# Altium schematic sheet FIT_TCM_ADCLK854.SchDoc: FIT_PM12 board
size 420 x 297 mm; CheckedBy: G.Kasprowicz; Author: INR Moscow; CompanyName: WUT ISE; DrawnBy: M.Podgórski; Organization: WUT ISE; Address1: PW ISE; Address2: Nowowiejska 15/19 00-665 Warsaw; Address3: gkasprow@gmail.com; Revision: 2; SheetNumber: -; SheetTotal: -; ModifiedBy: -; CheckedDate: -; Title2: Title 2; DivGrp: WUT ISE; Designer: INR RAS; ModifiedDate: -; ProjectName: Sensor Box
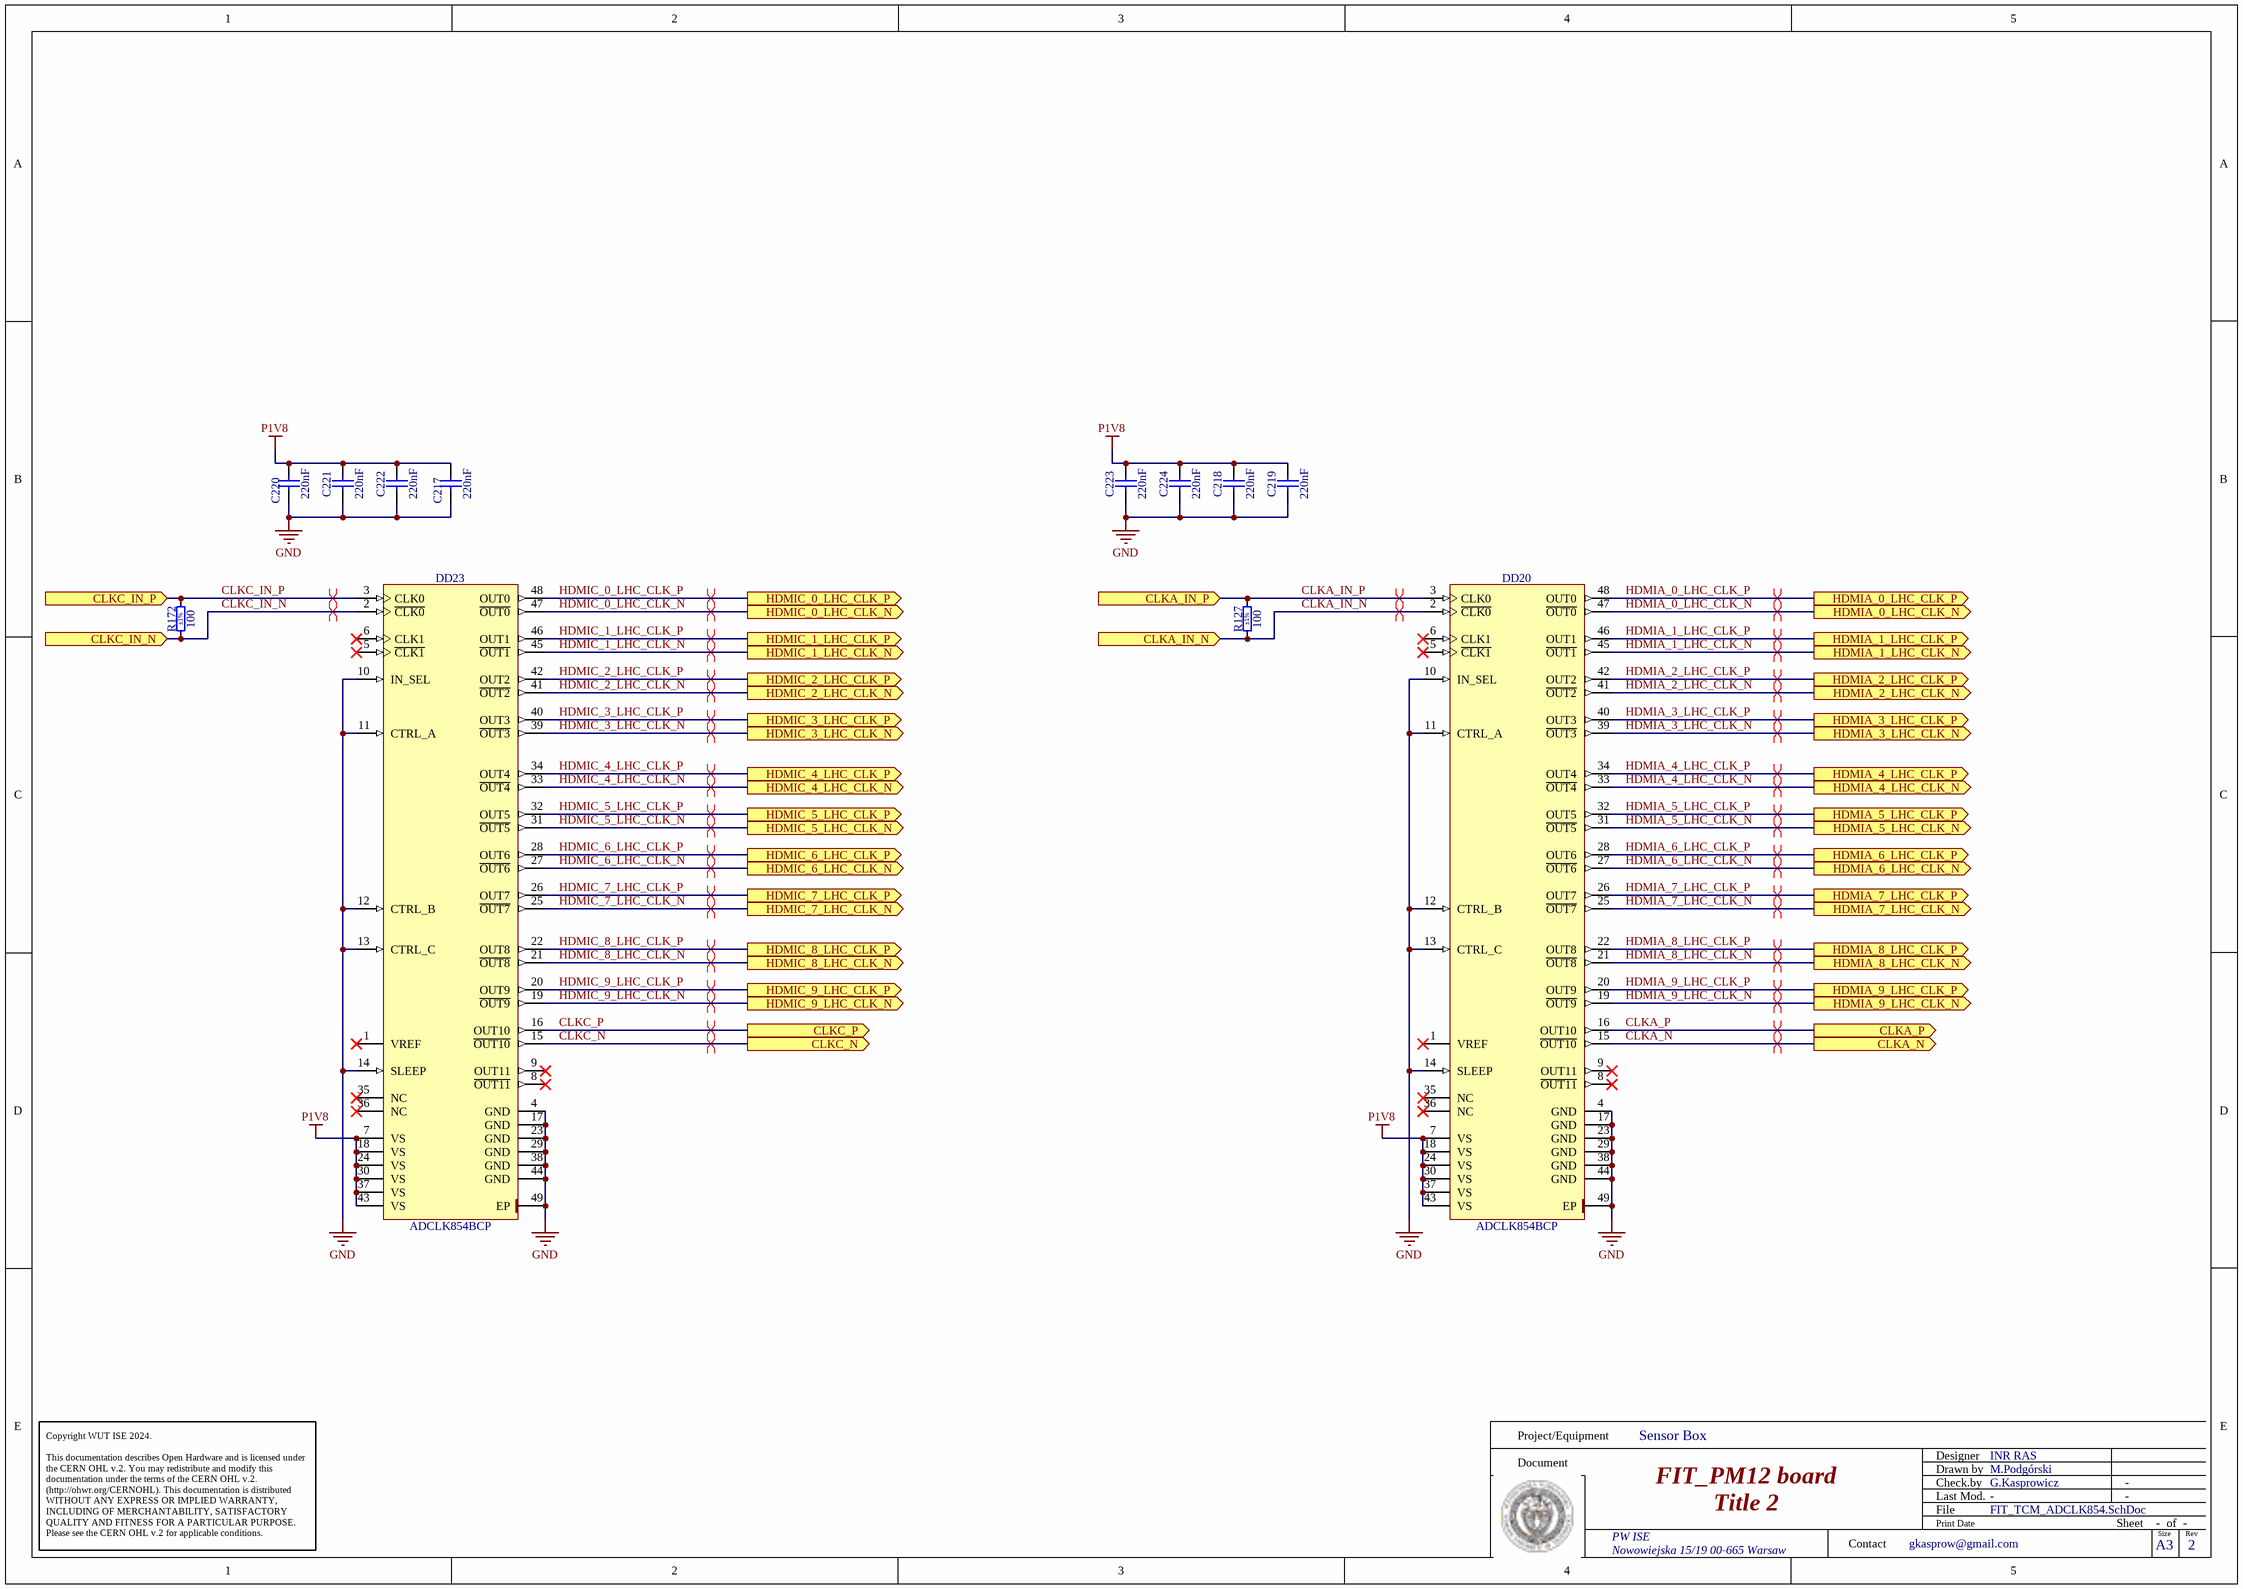
[diagram p0: FIT_TCM_ADCLK854.SchDoc]

## Parts
C217  220nF  [CAPC2012X135N]
C218  220nF  [CAPC2012X135N]
C219  220nF  [CAPC2012X135N]
C220  220nF  [CAPC2012X135N]
C221  220nF  [CAPC2012X135N]
C222  220nF  [CAPC2012X135N]
C223  220nF  [CAPC2012X135N]
C224  220nF  [CAPC2012X135N]
DD20  ADCLK854BCP  [QFN50P700X700X80-49N-S290]
DD23  ADCLK854BCP  [QFN50P700X700X80-49N-S290]
R127  100  Tolerance: ±1%  [RESC1608X55N]
R172  100  Tolerance: ±1%  [RESC1608X55N]

## Ports
CLKA_IN_N (in), CLKA_IN_P (in), CLKA_N (out), CLKA_P (out), CLKC_IN_N (in), CLKC_IN_P (in), CLKC_N (out), CLKC_P (out), HDMIA_0_LHC_CLK_N (out), HDMIA_0_LHC_CLK_P (out), HDMIA_1_LHC_CLK_N (out), HDMIA_1_LHC_CLK_P (out), HDMIA_2_LHC_CLK_N (out), HDMIA_2_LHC_CLK_P (out), HDMIA_3_LHC_CLK_N (out), HDMIA_3_LHC_CLK_P (out), HDMIA_4_LHC_CLK_N (out), HDMIA_4_LHC_CLK_P (out), HDMIA_5_LHC_CLK_N (out), HDMIA_5_LHC_CLK_P (out), HDMIA_6_LHC_CLK_N (out), HDMIA_6_LHC_CLK_P (out), HDMIA_7_LHC_CLK_N (out), HDMIA_7_LHC_CLK_P (out), HDMIA_8_LHC_CLK_N (out), HDMIA_8_LHC_CLK_P (out), HDMIA_9_LHC_CLK_N (out), HDMIA_9_LHC_CLK_P (out), HDMIC_0_LHC_CLK_N (out), HDMIC_0_LHC_CLK_P (out), HDMIC_1_LHC_CLK_N (out), HDMIC_1_LHC_CLK_P (out), HDMIC_2_LHC_CLK_N (out), HDMIC_2_LHC_CLK_P (out), HDMIC_3_LHC_CLK_N (out), HDMIC_3_LHC_CLK_P (out), HDMIC_4_LHC_CLK_N (out), HDMIC_4_LHC_CLK_P (out), HDMIC_5_LHC_CLK_N (out), HDMIC_5_LHC_CLK_P (out), HDMIC_6_LHC_CLK_N (out), HDMIC_6_LHC_CLK_P (out), HDMIC_7_LHC_CLK_N (out), HDMIC_7_LHC_CLK_P (out), HDMIC_8_LHC_CLK_N (out), HDMIC_8_LHC_CLK_P (out), HDMIC_9_LHC_CLK_N (out), HDMIC_9_LHC_CLK_P (out)

## Nets
GND: C217.1 C218.1 C219.1 C220.1 C221.1 C222.1 C223.1 C224.1 DD20.4(GND) DD20.10(IN_SEL) DD20.11(CTRL_A) DD20.12(CTRL_B) DD20.13(CTRL_C) DD20.14(SLEEP) DD20.17(GND) DD20.23(GND) DD20.29(GND) DD20.38(GND) DD20.44(GND) DD20.49(EP) DD23.4(GND) DD23.10(IN_SEL) DD23.11(CTRL_A) DD23.12(CTRL_B) DD23.13(CTRL_C) DD23.14(SLEEP) DD23.17(GND) DD23.23(GND) DD23.29(GND) DD23.38(GND) DD23.44(GND) DD23.49(EP)
P1V8: C217.2 C218.2 C219.2 C220.2 C221.2 C222.2 C223.2 C224.2 DD20.7(VS) DD20.18(VS) DD20.24(VS) DD20.30(VS) DD20.37(VS) DD20.43(VS) DD23.7(VS) DD23.18(VS) DD23.24(VS) DD23.30(VS) DD23.37(VS) DD23.43(VS)
CLKA_IN_N: DD20.2(~{CLK0}) R127.1 ; port CLKA_IN_N
CLKA_IN_P: DD20.3(CLK0) R127.2 ; port CLKA_IN_P
CLKA_N: DD20.15(~{OUT10}) ; port CLKA_N
CLKA_P: DD20.16(OUT10) ; port CLKA_P
CLKC_IN_N: DD23.2(~{CLK0}) R172.1 ; port CLKC_IN_N
CLKC_IN_P: DD23.3(CLK0) R172.2 ; port CLKC_IN_P
CLKC_N: DD23.15(~{OUT10}) ; port CLKC_N
CLKC_P: DD23.16(OUT10) ; port CLKC_P
HDMIA_0_LHC_CLK_N: DD20.47(~{OUT0}) ; port HDMIA_0_LHC_CLK_N
HDMIA_0_LHC_CLK_P: DD20.48(OUT0) ; port HDMIA_0_LHC_CLK_P
HDMIA_1_LHC_CLK_N: DD20.45(~{OUT1}) ; port HDMIA_1_LHC_CLK_N
HDMIA_1_LHC_CLK_P: DD20.46(OUT1) ; port HDMIA_1_LHC_CLK_P
HDMIA_2_LHC_CLK_N: DD20.41(~{OUT2}) ; port HDMIA_2_LHC_CLK_N
HDMIA_2_LHC_CLK_P: DD20.42(OUT2) ; port HDMIA_2_LHC_CLK_P
HDMIA_3_LHC_CLK_N: DD20.39(~{OUT3}) ; port HDMIA_3_LHC_CLK_N
HDMIA_3_LHC_CLK_P: DD20.40(OUT3) ; port HDMIA_3_LHC_CLK_P
HDMIA_4_LHC_CLK_N: DD20.33(~{OUT4}) ; port HDMIA_4_LHC_CLK_N
HDMIA_4_LHC_CLK_P: DD20.34(OUT4) ; port HDMIA_4_LHC_CLK_P
HDMIA_5_LHC_CLK_N: DD20.31(~{OUT5}) ; port HDMIA_5_LHC_CLK_N
HDMIA_5_LHC_CLK_P: DD20.32(OUT5) ; port HDMIA_5_LHC_CLK_P
HDMIA_6_LHC_CLK_N: DD20.27(~{OUT6}) ; port HDMIA_6_LHC_CLK_N
HDMIA_6_LHC_CLK_P: DD20.28(OUT6) ; port HDMIA_6_LHC_CLK_P
HDMIA_7_LHC_CLK_N: DD20.25(~{OUT7}) ; port HDMIA_7_LHC_CLK_N
HDMIA_7_LHC_CLK_P: DD20.26(OUT7) ; port HDMIA_7_LHC_CLK_P
HDMIA_8_LHC_CLK_N: DD20.21(~{OUT8}) ; port HDMIA_8_LHC_CLK_N
HDMIA_8_LHC_CLK_P: DD20.22(OUT8) ; port HDMIA_8_LHC_CLK_P
HDMIA_9_LHC_CLK_N: DD20.19(~{OUT9}) ; port HDMIA_9_LHC_CLK_N
HDMIA_9_LHC_CLK_P: DD20.20(OUT9) ; port HDMIA_9_LHC_CLK_P
HDMIC_0_LHC_CLK_N: DD23.47(~{OUT0}) ; port HDMIC_0_LHC_CLK_N
HDMIC_0_LHC_CLK_P: DD23.48(OUT0) ; port HDMIC_0_LHC_CLK_P
HDMIC_1_LHC_CLK_N: DD23.45(~{OUT1}) ; port HDMIC_1_LHC_CLK_N
HDMIC_1_LHC_CLK_P: DD23.46(OUT1) ; port HDMIC_1_LHC_CLK_P
HDMIC_2_LHC_CLK_N: DD23.41(~{OUT2}) ; port HDMIC_2_LHC_CLK_N
HDMIC_2_LHC_CLK_P: DD23.42(OUT2) ; port HDMIC_2_LHC_CLK_P
HDMIC_3_LHC_CLK_N: DD23.39(~{OUT3}) ; port HDMIC_3_LHC_CLK_N
HDMIC_3_LHC_CLK_P: DD23.40(OUT3) ; port HDMIC_3_LHC_CLK_P
HDMIC_4_LHC_CLK_N: DD23.33(~{OUT4}) ; port HDMIC_4_LHC_CLK_N
HDMIC_4_LHC_CLK_P: DD23.34(OUT4) ; port HDMIC_4_LHC_CLK_P
HDMIC_5_LHC_CLK_N: DD23.31(~{OUT5}) ; port HDMIC_5_LHC_CLK_N
HDMIC_5_LHC_CLK_P: DD23.32(OUT5) ; port HDMIC_5_LHC_CLK_P
HDMIC_6_LHC_CLK_N: DD23.27(~{OUT6}) ; port HDMIC_6_LHC_CLK_N
HDMIC_6_LHC_CLK_P: DD23.28(OUT6) ; port HDMIC_6_LHC_CLK_P
HDMIC_7_LHC_CLK_N: DD23.25(~{OUT7}) ; port HDMIC_7_LHC_CLK_N
HDMIC_7_LHC_CLK_P: DD23.26(OUT7) ; port HDMIC_7_LHC_CLK_P
HDMIC_8_LHC_CLK_N: DD23.21(~{OUT8}) ; port HDMIC_8_LHC_CLK_N
HDMIC_8_LHC_CLK_P: DD23.22(OUT8) ; port HDMIC_8_LHC_CLK_P
HDMIC_9_LHC_CLK_N: DD23.19(~{OUT9}) ; port HDMIC_9_LHC_CLK_N
HDMIC_9_LHC_CLK_P: DD23.20(OUT9) ; port HDMIC_9_LHC_CLK_P

Not connected (* = marked no-connect by the designer): DD20 1(VREF)* 5(~{CLK1})* 6(CLK1)* 8(~{OUT11})* 9(OUT11)* 35(NC)* 36(NC)*; DD23 1(VREF)* 5(~{CLK1})* 6(CLK1)* 8(~{OUT11})* 9(OUT11)* 35(NC)* 36(NC)*

## Layout directives
differential pair: CLKA_IN_N, CLKA_IN_P, CLKA_N, CLKA_P, CLKC_IN_N, CLKC_IN_P, CLKC_N, CLKC_P, HDMIA_0_LHC_CLK_N, HDMIA_0_LHC_CLK_P, HDMIA_1_LHC_CLK_N, HDMIA_1_LHC_CLK_P, HDMIA_2_LHC_CLK_N, HDMIA_2_LHC_CLK_P, HDMIA_3_LHC_CLK_N, HDMIA_3_LHC_CLK_P, HDMIA_4_LHC_CLK_N, HDMIA_4_LHC_CLK_P, HDMIA_5_LHC_CLK_N, HDMIA_5_LHC_CLK_P, HDMIA_6_LHC_CLK_N, HDMIA_6_LHC_CLK_P, HDMIA_7_LHC_CLK_N, HDMIA_7_LHC_CLK_P, HDMIA_8_LHC_CLK_N, HDMIA_8_LHC_CLK_P, HDMIA_9_LHC_CLK_N, HDMIA_9_LHC_CLK_P, HDMIC_0_LHC_CLK_N, HDMIC_0_LHC_CLK_P, HDMIC_1_LHC_CLK_N, HDMIC_1_LHC_CLK_P, HDMIC_2_LHC_CLK_N, HDMIC_2_LHC_CLK_P, HDMIC_3_LHC_CLK_N, HDMIC_3_LHC_CLK_P, HDMIC_4_LHC_CLK_N, HDMIC_4_LHC_CLK_P, HDMIC_5_LHC_CLK_N, HDMIC_5_LHC_CLK_P, HDMIC_6_LHC_CLK_N, HDMIC_6_LHC_CLK_P, HDMIC_7_LHC_CLK_N, HDMIC_7_LHC_CLK_P, HDMIC_8_LHC_CLK_N, HDMIC_8_LHC_CLK_P, HDMIC_9_LHC_CLK_N, HDMIC_9_LHC_CLK_P

## Notes on the sheet
- Project/Equipment
- Document
- Designer
- Drawn by
- Check.by
- Copyright WUT ISE 2024.
  This documentation describes Open Hardware and is licensed under the CERN OHL v.2. You may redistribute and modify this documentation under the terms of the CERN OHL v.2. (http://ohwr.org/CERNOHL). This documentation is distributed WITHOUT ANY EXPRESS OR IMPLIED WARRANTY, INCLUDING OF MERCHANTABILITY, SATISFACTORY QUALITY AND FITNESS FOR A PARTICULAR PURPOSE. Please see the CERN OHL v.2 for applicable conditions.
- Contact
- File
- Last Mod.
- Print Date
- Sheet
- Size
- A3
- of
- Rev

## Library data of the parts
C217-C224 = CC0805_220NF_50V_10%_X7R: Non-polarised capacitor; Part Description: SMD Multilayer Chip Ceramic Capacitor; Manufacturer: GENERIC; Manufacturer1 Part Number: GRM21BR71H224KA01L; Voltage: 50V; TC: X7R; Tolerance: ±10%; Part Number: CC0805_220NF_50V_10%_X7R; Component Kind: Standard; Component Type: Standard; Pin Count: 2; Value: 220nF; Status: Preferred; Manufacturer Part Number: CC0805_220NF_50V_10%_X7R; Case: 0805; Mounted: Yes; Socket: No; SMD: Yes; Sense: No; Manufacturer1 Example: MURATA; Manufacturer1 ComponentHeight: 1.35mm; HelpURL: \\cern.ch\dfs\Applications\Altium\Datasheets\CC0805_X7R_MURATA.pdf; Author: CERN DEM JLC; CreateDate: 03.12.2007; LatestRevisionDate: 03.12.2007
DD20 DD23 = ADCLK854BCP: 1.8 V, 6 LVDS/12 CMOS Outputs Low Power Clock Fanout Buffer; Manufacturer: ANALOG DEVICES; PressFit: No; Bonding: No; Part Number: ADCLK854BCP; Component Kind: Standard; Component Type: Standard; Device: ADCLK854BCP; PackageDescription: QFN, 0.50mm Pitch, Square; 48 Pin, 7.00mm L X 7.00mm W X 0.80mm H body (w/Thermal Tab 2.9 x 2.9mm), IPC Medium Density; Part Description: 1.8 V, 6 LVDS/12 CMOS Outputs Low Power Clock Fanout Buffer; Manufacturer Part Number: ADCLK854BCP; Pin Count: 49; Case: QFN48; Mounted: Yes; Socket: No; SMD: Yes; Sense: No; ComponentHeight: 0.8mm; Author: CERN DEM HF; HelpURL: \\cern.ch\dfs\Applications\Altium\Datasheets\ADCLK854BCP.pdf; CreateDate: 24.05.2024; LatestRevisionDate: 24.05.2024
R127 R172 = R0603_100R_1%_0.1W_100PPM: Resistor - 1%; Part Description: General Purpose Thick Film Chip Resistor; Manufacturer: GENERIC; Manufacturer1 Part Number: NRC06F4700TRF; Power: 0.1W; TC: ±100ppm/°C; PressFit: No; Part Number: R0603_100R_1%_0.1W_100PPM; Component Kind: Standard; Component Type: Standard; Pin Count: 2; Value: 100; Status: Preferred; Manufacturer Part Number: R0603_100R_1%_0.1W_100PPM; Case: 0603; Mounted: Yes; Sense: No; Socket: No; SMD: Yes; Manufacturer1 Example: NIC COMPONENT; Manufacturer1 ComponentHeight: 0.55mm; HelpURL: \\cern.ch\dfs\Applications\Altium\Datasheets\R0603_NIC_NRC.pdf; Author: CERN DEM JLC; CreateDate: 03.12.2007; LatestRevisionDate: 13.03.2008